# Altium schematic sheet Attenuator.SchDoc
size A4
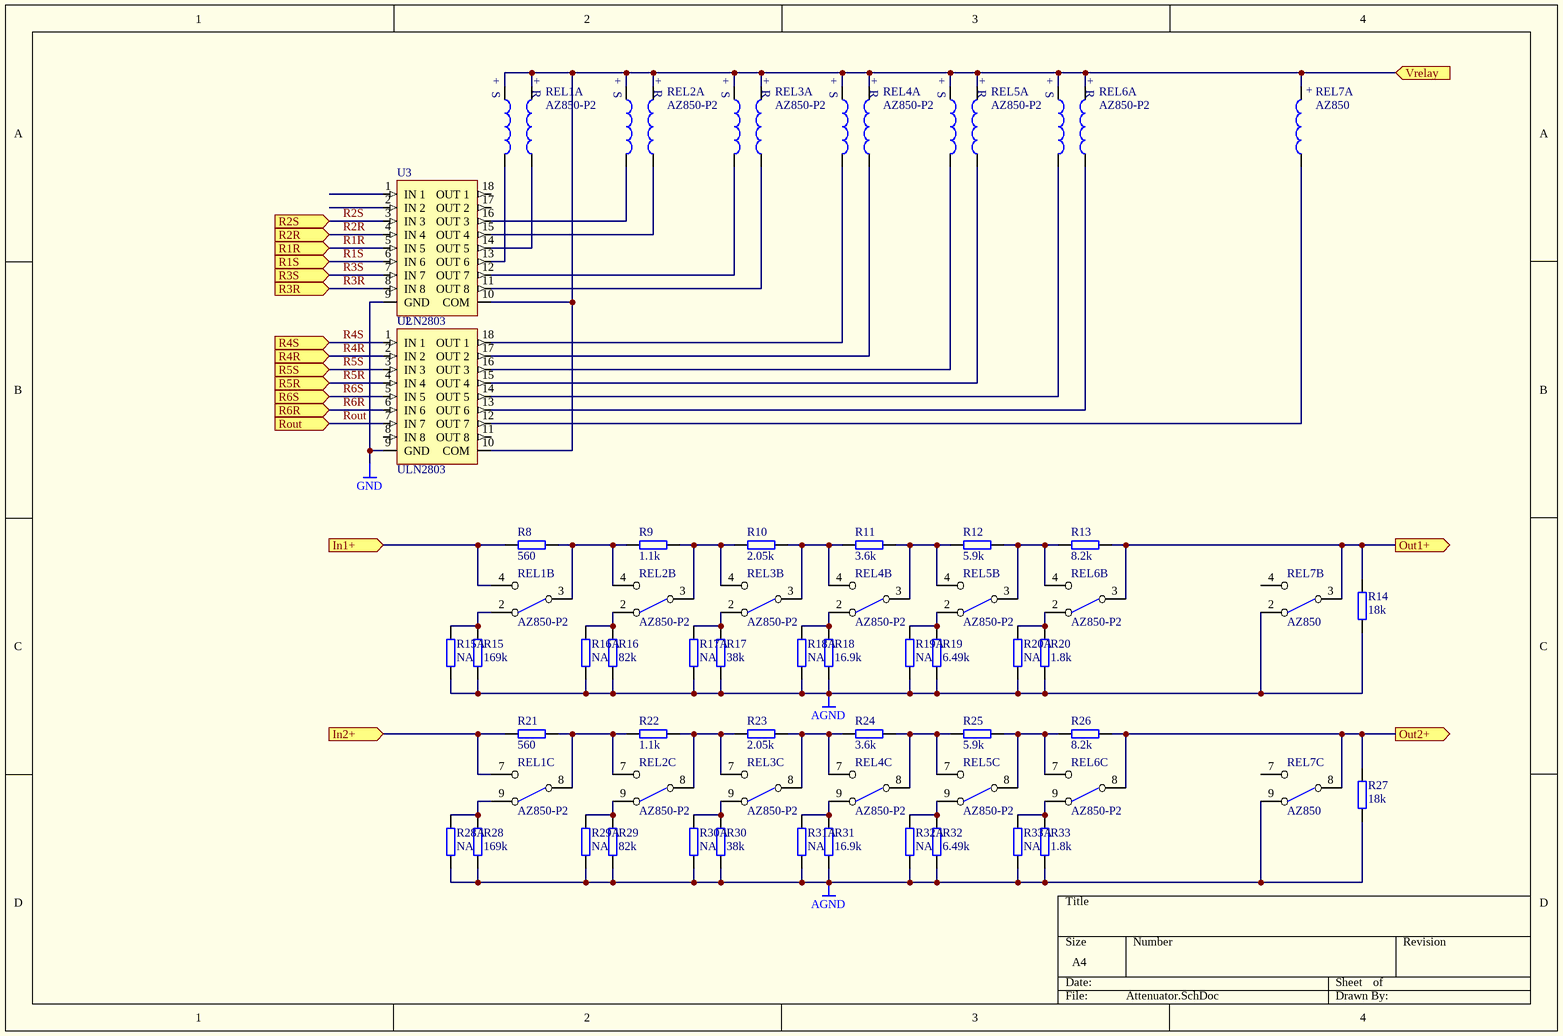
[diagram p0: Attenuator.SchDoc]

## Parts
(Parts that share a designator on the sheet are numbered #1, #2 ... from top to bottom, then left to right.)
R8  560  [R400_1]
R9  1.1k  [R400_1]
R10  2.05k  [R400_1]
R11  3.6k  [R400_1]
R12  5.9k  [R400_1]
R13  8.2k  [R400_1]
R14  18k  [R400_1]
R15  169k  [R400_1]
R15A  NA  [R400_1]
R16  82k  [R400_1]
R16A  NA  [R400_1]
R17  38k  [R400_1]
R17A  NA  [R400_1]
R18  16.9k  [R400_1]
R18A  NA  [R400_1]
R19  6.49k  [R400_1]
R19A  NA  [R400_1]
R20  1.8k  [R400_1]
R20A  NA  [R400_1]
R21  560  [R400_1]
R22  1.1k  [R400_1]
R23  2.05k  [R400_1]
R24  3.6k  [R400_1]
R25  5.9k  [R400_1]
R26  8.2k  [R400_1]
R27  18k  [R400_1]
R28  169k  [R400_1]
R28A  NA  [R400_1]
R29  82k  [R400_1]
R29A  NA  [R400_1]
R30  38k  [R400_1]
R30A  NA  [R400_1]
R31  16.9k  [R400_1]
R31A  NA  [R400_1]
R32  6.49k  [R400_1]
R32A  NA  [R400_1]
R33  1.8k  [R400_1]
R33A  NA  [R400_1]
REL1#1  AZ850-P2  [RELAY_AZ850]  (part A of 3)
REL1#2  AZ850-P2  [RELAY_AZ850]  (parts B,C of 3)
REL2#1  AZ850-P2  [RELAY_AZ850]  (part A of 3)
REL2#2  AZ850-P2  [RELAY_AZ850]  (parts B,C of 3)
REL3#1  AZ850-P2  [RELAY_AZ850]  (part A of 3)
REL3#2  AZ850-P2  [RELAY_AZ850]  (parts B,C of 3)
REL4#1  AZ850-P2  [RELAY_AZ850]  (part A of 3)
REL4#2  AZ850-P2  [RELAY_AZ850]  (parts B,C of 3)
REL5#1  AZ850-P2  [RELAY_AZ850]  (part A of 3)
REL5#2  AZ850-P2  [RELAY_AZ850]  (parts B,C of 3)
REL6#1  AZ850-P2  [RELAY_AZ850]  (part A of 3)
REL6#2  AZ850-P2  [RELAY_AZ850]  (parts B,C of 3)
REL7  AZ850  [RELAY_AZ850]  (parts A,B,C of 3)
U2  ULN2803  [SOIC-18]
U3  ULN2803  [SOIC-18]

## Ports
In1+ (in), In2+ (in), Out1+ (out), Out2+ (out), R1R (in), R1S (in), R2R (in), R2S (in), R3R (in), R3S (in), R4R (in), R4S (in), R5R (in), R5S (in), R6R (in), R6S (in), Rout (in), Vrelay (in)

## Nets
AGND: R14.1 R15.1 R15A.1 R16.1 R16A.1 R17.1 R17A.1 R18.1 R18A.1 R19.1 R19A.1 R20.1 R20A.1 R27.1 R28.1 R28A.1 R29.1 R29A.1 R30.1 R30A.1 R31.1 R31A.1 R32.1 R32A.1 R33.1 R33A.1 REL7.2 REL7.9
GND: U2.9(GND) U3.9(GND)
In1+: R8.1 REL1#2.4 ; port In1+
In2+: R21.1 REL1#2.7 ; port In2+
Out1+: R13.2 R14.2 REL6#2.3 REL7.3 ; port Out1+
Out2+: R26.2 R27.2 REL6#2.8 REL7.8 ; port Out2+
R1R: U3.5(IN_5) ; port R1R
R1S: U3.6(IN_6) ; port R1S
R2R: U3.4(IN_4) ; port R2R
R2S: U3.3(IN_3) ; port R2S
R3R: U3.8(IN_8) ; port R3R
R3S: U3.7(IN_7) ; port R3S
R4R: U2.2(IN_2) ; port R4R
R4S: U2.1(IN_1) ; port R4S
R5R: U2.4(IN_4) ; port R5R
R5S: U2.3(IN_3) ; port R5S
R6R: U2.6(IN_6) ; port R6R
R6S: U2.5(IN_5) ; port R6S
Rout: U2.7(IN_7) ; port Rout
Vrelay: REL1#1.1 REL1#1.10 REL2#1.1 REL2#1.10 REL3#1.1 REL3#1.10 REL4#1.1 REL4#1.10 REL5#1.1 REL5#1.10 REL6#1.1 REL6#1.10 REL7.1 U2.10(COM) U3.10(COM) ; port Vrelay
NetR8_2: R8.2 R9.1 REL1#2.3 REL2#2.4
NetR9_2: R9.2 R10.1 REL2#2.3 REL3#2.4
NetR10_2: R10.2 R11.1 REL3#2.3 REL4#2.4
NetR11_2: R11.2 R12.1 REL4#2.3 REL5#2.4
NetR12_2: R12.2 R13.1 REL5#2.3 REL6#2.4
NetR15_2: R15.2 R15A.2 REL1#2.2
NetR16_2: R16.2 R16A.2 REL2#2.2
NetR17_2: R17.2 R17A.2 REL3#2.2
NetR18_2: R18.2 R18A.2 REL4#2.2
NetR19_2: R19.2 R19A.2 REL5#2.2
NetR20_2: R20.2 R20A.2 REL6#2.2
NetR21_2: R21.2 R22.1 REL1#2.8 REL2#2.7
NetR22_2: R22.2 R23.1 REL2#2.8 REL3#2.7
NetR23_2: R23.2 R24.1 REL3#2.8 REL4#2.7
NetR24_2: R24.2 R25.1 REL4#2.8 REL5#2.7
NetR25_2: R25.2 R26.1 REL5#2.8 REL6#2.7
NetR28_2: R28.2 R28A.2 REL1#2.9
NetR29_2: R29.2 R29A.2 REL2#2.9
NetR30_2: R30.2 R30A.2 REL3#2.9
NetR31_2: R31.2 R31A.2 REL4#2.9
NetR32_2: R32.2 R32A.2 REL5#2.9
NetR33_2: R33.2 R33A.2 REL6#2.9
NetREL1#1_5: REL1#1.5 U3.13(OUT_6)
NetREL1#1_6: REL1#1.6 U3.14(OUT_5)
NetREL2#1_5: REL2#1.5 U3.16(OUT_3)
NetREL2#1_6: REL2#1.6 U3.15(OUT_4)
NetREL3#1_5: REL3#1.5 U3.12(OUT_7)
NetREL3#1_6: REL3#1.6 U3.11(OUT_8)
NetREL4#1_5: REL4#1.5 U2.18(OUT_1)
NetREL4#1_6: REL4#1.6 U2.17(OUT_2)
NetREL5#1_5: REL5#1.5 U2.16(OUT_3)
NetREL5#1_6: REL5#1.6 U2.15(OUT_4)
NetREL6#1_5: REL6#1.5 U2.14(OUT_5)
NetREL6#1_6: REL6#1.6 U2.13(OUT_6)
NetREL7_10: REL7.10 U2.12(OUT_7)

Not connected (* = marked no-connect by the designer): REL7 4 7; U2 8(IN_8) 11(OUT_8); U3 1(IN_1) 2(IN_2) 17(OUT_2) 18(OUT_1)

## Notes on the sheet
- (in symbol AZ850, part A) +; S; R

## Library data of the parts
R8-R15 R15A R16 R16A R17 R17A R18 R18A R19 R19A R20 R20A R21-R28 R28A R29 R29A R30 R30A R31 R31A R32 R32A R33 R33A = RES: Resistor
REL1#1 REL2#1 REL3#1 REL4#1 REL5#1 REL6#1 REL7 = AZ850: bi-stable relay
REL1#2 REL2#2 REL3#2 REL4#2 REL5#2 REL6#2 = AZ850-P2: bi-stable relay
U2 U3 = ULN2803: HIGH-VOLTAGE,HIGH-CURRENT DARLINTON ARRAYS